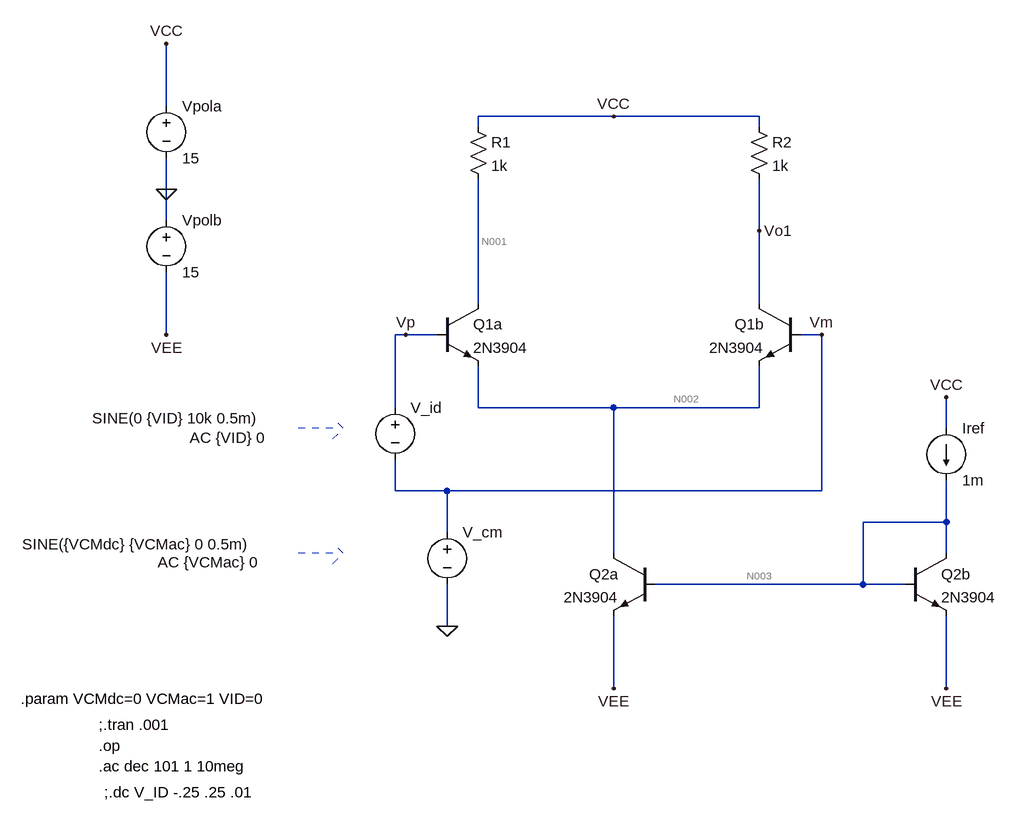
[diagram p0: schematic laboE1_1.asc]
laboE1_1.asc, the LTspice schematic file:
Version 4
SHEET 1 2404 1432
WIRE -400 16 -400 -80
WIRE 288 32 80 32
WIRE 512 32 288 32
WIRE 80 48 80 32
WIRE 512 48 512 32
WIRE -400 144 -400 96
WIRE -400 192 -400 144
WIRE 512 208 512 128
WIRE 80 320 80 128
WIRE 512 320 512 208
WIRE -400 368 -400 272
WIRE -32 368 -48 368
WIRE 16 368 -32 368
WIRE 608 368 576 368
WIRE -48 480 -48 368
WIRE 80 480 80 416
WIRE 288 480 80 480
WIRE 512 480 512 416
WIRE 512 480 288 480
WIRE 800 512 800 464
WIRE -48 608 -48 560
WIRE 32 608 -48 608
WIRE 608 608 608 368
WIRE 608 608 32 608
WIRE 800 656 800 592
WIRE 800 656 672 656
WIRE 32 672 32 608
WIRE 288 704 288 480
WIRE 800 704 800 656
WIRE 672 752 672 656
WIRE 672 752 352 752
WIRE 736 752 672 752
WIRE 32 816 32 752
WIRE 288 912 288 800
WIRE 800 912 800 800
FLAG 288 32 VCC
FLAG -400 -80 VCC
FLAG -400 368 VEE
FLAG -400 144 0
FLAG 288 912 VEE
FLAG 512 208 Vo1
FLAG 800 464 VCC
FLAG 608 368 Vm
FLAG -32 368 Vp
FLAG 800 912 VEE
FLAG 32 816 0
SYMBOL npn 16 320 R0
SYMATTR InstName Q1a
SYMATTR Value 2N3904
SYMBOL npn 576 320 M0
SYMATTR InstName Q1b
SYMATTR Value 2N3904
SYMBOL voltage -400 0 R0
WINDOW 123 0 0 Left 0
WINDOW 39 0 0 Left 0
SYMATTR InstName Vpola
SYMATTR Value 15
SYMBOL voltage -400 176 R0
WINDOW 123 0 0 Left 0
WINDOW 39 0 0 Left 0
SYMATTR InstName Vpolb
SYMATTR Value 15
SYMBOL npn 352 704 M0
SYMATTR InstName Q2a
SYMATTR Value 2N3904
SYMBOL npn 736 704 R0
SYMATTR InstName Q2b
SYMATTR Value 2N3904
SYMBOL voltage 32 656 R0
WINDOW 123 -445 62 Left 2
WINDOW 39 0 0 Left 0
WINDOW 3 -654 34 Left 2
SYMATTR Value2 AC {VCMac} 0
SYMATTR Value SINE({VCMdc} {VCMac} 0 0.5m)
SYMATTR InstName V_cm
SYMBOL current 800 512 R0
SYMATTR InstName Iref
SYMATTR Value 1m
SYMBOL voltage -48 464 R0
WINDOW 123 -316 62 Left 2
WINDOW 39 0 0 Left 0
WINDOW 3 -466 32 Left 2
SYMATTR Value2 AC {VID} 0
SYMATTR Value SINE(0 {VID} 10k 0.5m)
SYMATTR InstName V_id
SYMBOL res 64 32 R0
SYMATTR InstName R1
SYMATTR Value 1k
SYMBOL res 496 32 R0
SYMATTR InstName R2
SYMATTR Value 1k
TEXT -504 1000 Left 2 !.op
TEXT -504 1032 Left 2 !.ac dec 101 1 10meg
TEXT -504 968 Left 2 !;.tran .001
TEXT -624 928 Left 2 !.param VCMdc=0 VCMac=1 VID=0
TEXT -496 1072 Left 2 !;.dc V_ID -.25 .25 .01
LINE Normal -144 512 -208 512 2
LINE Normal -144 704 -208 704 2
LINE Normal -144 704 -144 704 2
LINE Normal -128 704 -144 688 2
LINE Normal -144 720 -128 704 2
LINE Normal -128 512 -144 496 2
LINE Normal -144 528 -128 512 2

The netlist it stands for:
* laboE1_1.asc
Q1a N001 Vp N002 0 2N3904
Q1b Vo1 Vm N002 0 2N3904
Vpola VCC 0 15
Vpolb 0 VEE 15
Q2a N002 N003 VEE 0 2N3904
Q2b N003 N003 VEE 0 2N3904
V_cm Vm 0 SINE({VCMdc} {VCMac} 0 0.5m) AC {VCMac} 0
Iref VCC N003 1m
V_id Vp Vm SINE(0 {VID} 10k 0.5m) AC {VID} 0
R1 VCC N001 1k
R2 VCC Vo1 1k
.model NPN NPN
.model PNP PNP
.lib standard.bjt
.op
.ac dec 101 1 10meg
;.tran .001
.param VCMdc=0 VCMac=1 VID=0
;.dc V_ID -.25 .25 .01
.backanno
.end

* Results of the author's LTspice run, read from the files saved beside the schematic
* Operating Point, zero values left out:
*   V(n001) = 14.44 V
*   V(n002) = -636.9 mV
*   V(vo1) = 14.44 V
*   V(vcc) = 15 V
*   V(vee) = -15 V
*   V(n003) = -14.34 V
*   Ic(Q1a) = 562.8 µA
*   Ib(Q1a) = 1.641 µA
*   Ie(Q1a) = -564.5 µA
*   Ic(Q1b) = 562.8 µA
*   Ib(Q1b) = 1.641 µA
*   Ie(Q1b) = -564.5 µA
*   Ic(Q2a) = 1.129 mA
*   Ib(Q2a) = 3.318 µA
*   Ie(Q2a) = -1.132 mA
*   Ic(Q2b) = 993.4 µA
*   Ib(Q2b) = 3.319 µA
*   Ie(Q2b) = -996.7 µA
*   I(Iref) = 1 mA
*   I(R1) = 562.8 µA
*   I(R2) = 562.8 µA
*   I(Vpola) = -2.126 mA
*   I(Vpolb) = -2.129 mA
*   I(V_cm) = -3.283 µA
*   I(V_id) = -1.641 µA
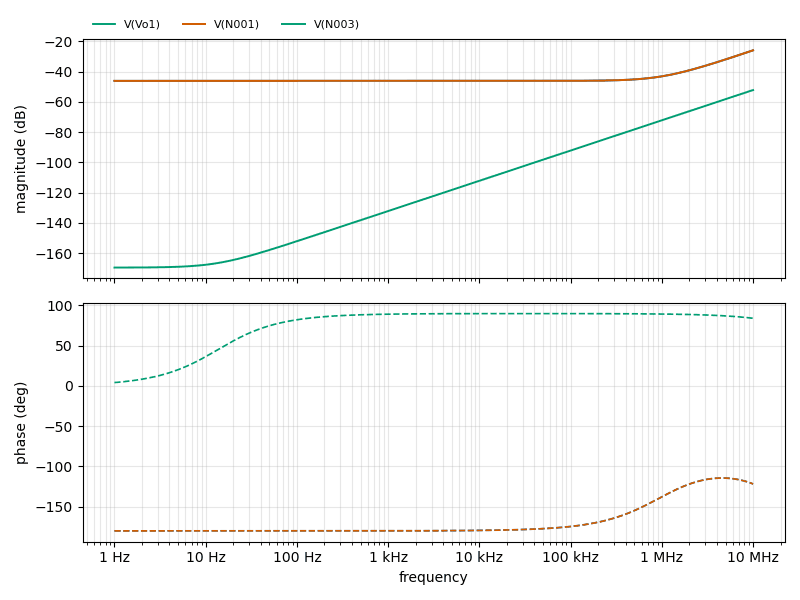
[diagram p1: AC Analysis of laboE1_1.asc, plotted from the saved traces]
* AC Analysis, 1 run:
*   V(Vo1): -46.18 dB at 1 Hz, -25.98 dB at 10 MHz, peak -25.98 dB at 10 MHz, 3 dB below the peak at 7.107 MHz
*   V(N001): -46.18 dB at 1 Hz, -25.98 dB at 10 MHz, peak -25.98 dB at 10 MHz, 3 dB below the peak at 7.107 MHz
*   V(N003): -169.54 dB at 1 Hz, -52.23 dB at 10 MHz, peak -52.23 dB at 10 MHz, 3 dB below the peak at 7.054 MHz
* From the log:
*   Semiconductor Device Operating Points:
*                           --- Bipolar Transistors ---
*   Name:       q1a         q1b         q2a         q2b
*   Model:    2n3904      2n3904      2n3904      2n3904
*   Ib:       1.64e-06    1.64e-06    3.32e-06    3.32e-06
*   Ic:       5.63e-04    5.63e-04    1.13e-03    9.93e-04
*   Vbe:      6.37e-01    6.37e-01    6.55e-01    6.55e-01
*   Vbc:     -1.44e+01   -1.44e+01   -1.37e+01    0.00e+00
*   Vce:      1.51e+01    1.51e+01    1.44e+01    6.55e-01
*   BetaDC:   3.43e+02    3.43e+02    3.40e+02    2.99e+02
*   Gm:       2.17e-02    2.17e-02    4.35e-02    3.83e-02
*   Rpi:      1.58e+04    1.58e+04    7.80e+03    7.79e+03
*   Rx:       2.00e+01    2.00e+01    2.00e+01    2.00e+01
*   Ro:       2.03e+05    2.03e+05    1.01e+05    1.01e+05
*   Cbe:      2.00e-11    2.00e-11    2.78e-11    2.59e-11
*   Cbc:      1.48e-12    1.48e-12    1.51e-12    4.00e-12
*   Cjs:      0.00e+00    0.00e+00    0.00e+00    0.00e+00
*   BetaAC:   3.42e+02    3.42e+02    3.39e+02    2.98e+02
*   Cbx:      0.00e+00    0.00e+00    0.00e+00    0.00e+00
*   Ft:       1.61e+08    1.61e+08    2.37e+08    2.04e+08